# Altium schematic sheet fpga_sheet.SchDoc
size A4
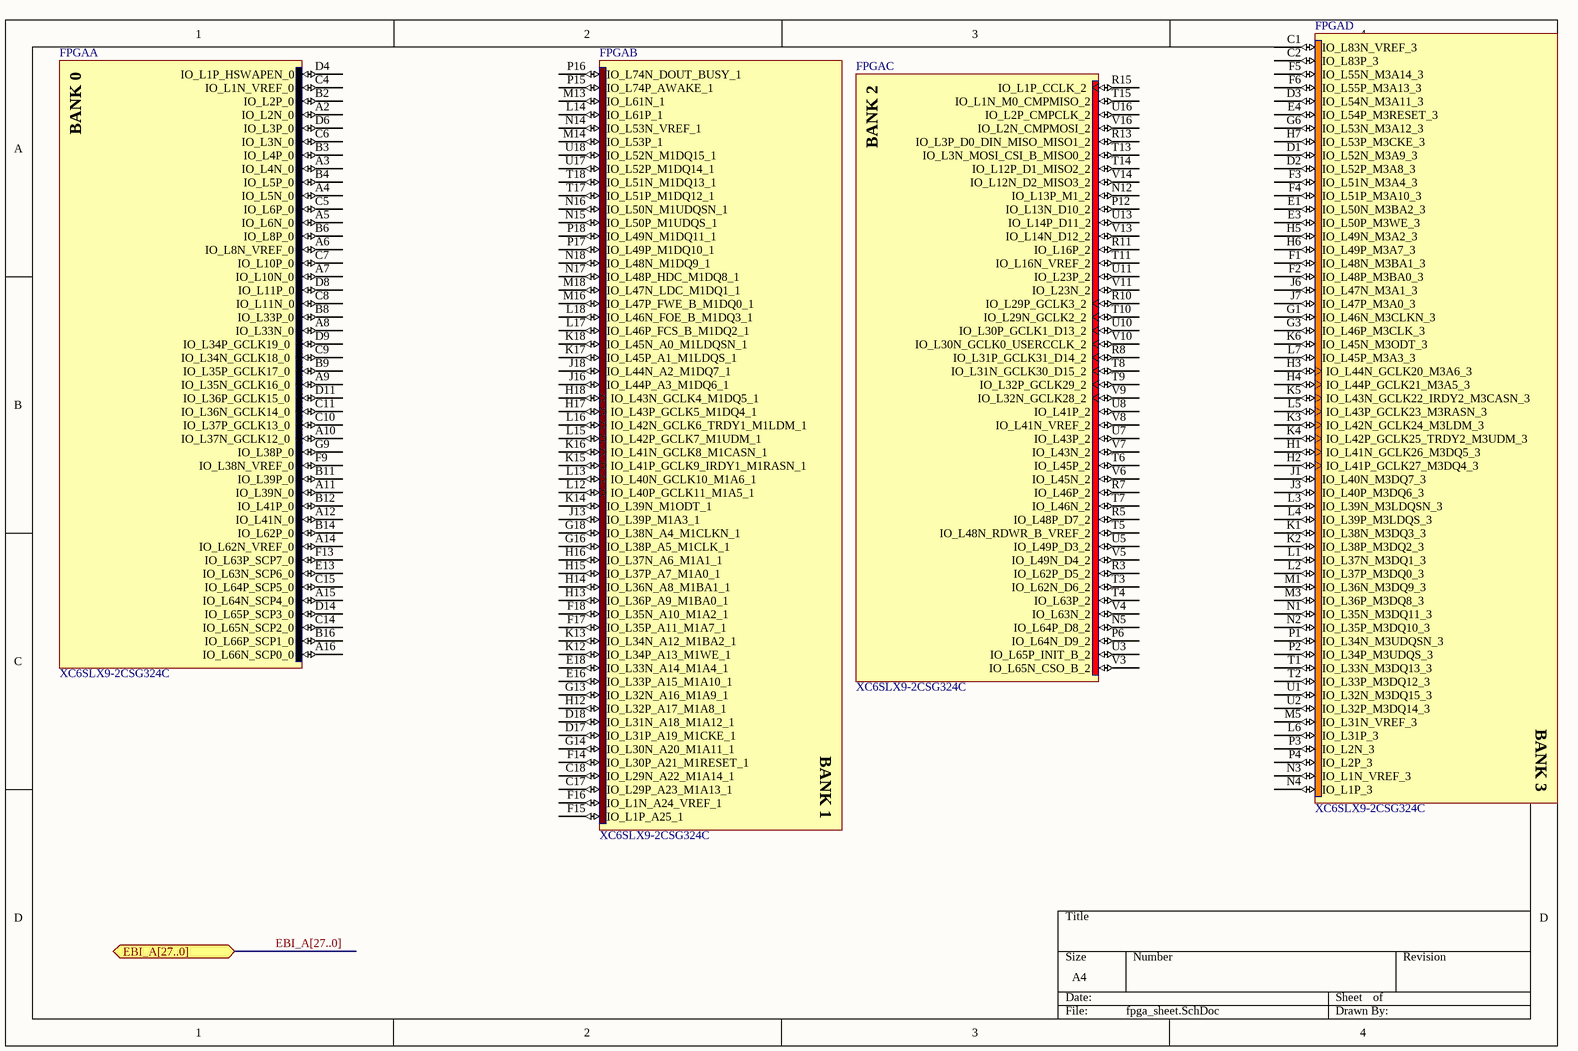
[diagram p0: fpga_sheet.SchDoc]

## Parts
FPGA  XC6SLX9-2CSG324C  [CSG324]  (parts A,B,C,D of 8)

## Ports
EBI_A[27..0]

## Nets

Not connected (* = marked no-connect by the designer): FPGA A2(IO_L2N_0) A3(IO_L4N_0) A4(IO_L5N_0) A5(IO_L6N_0) A6(IO_L8N_VREF_0) A7(IO_L10N_0) A8(IO_L33N_0) A9(IO_L35N_GCLK16_0) A10(IO_L37N_GCLK12_0) A11(IO_L39N_0) A12(IO_L41N_0) A14(IO_L62N_VREF_0) A15(IO_L64N_SCP4_0) A16(IO_L66N_SCP0_0) B2(IO_L2P_0) B3(IO_L4P_0) B4(IO_L5P_0) B6(IO_L8P_0) B8(IO_L33P_0) B9(IO_L35P_GCLK17_0) B11(IO_L39P_0) B12(IO_L41P_0) B14(IO_L62P_0) B16(IO_L66P_SCP1_0) C1(IO_L83N_VREF_3) C2(IO_L83P_3) C4(IO_L1N_VREF_0) C5(IO_L6P_0) C6(IO_L3N_0) C7(IO_L10P_0) C8(IO_L11N_0) C9(IO_L34N_GCLK18_0) C10(IO_L37P_GCLK13_0) C11(IO_L36N_GCLK14_0) C14(IO_L65N_SCP2_0) C15(IO_L64P_SCP5_0) C17(IO_L29P_A23_M1A13_1) C18(IO_L29N_A22_M1A14_1) D1(IO_L52N_M3A9_3) D2(IO_L52P_M3A8_3) D3(IO_L54N_M3A11_3) D4(IO_L1P_HSWAPEN_0) D6(IO_L3P_0) D8(IO_L11P_0) D9(IO_L34P_GCLK19_0) D11(IO_L36P_GCLK15_0) D14(IO_L65P_SCP3_0) D17(IO_L31P_A19_M1CKE_1) D18(IO_L31N_A18_M1A12_1) E1(IO_L50N_M3BA2_3) E3(IO_L50P_M3WE_3) E4(IO_L54P_M3RESET_3) E13(IO_L63N_SCP6_0) E16(IO_L33P_A15_M1A10_1) E18(IO_L33N_A14_M1A4_1) F1(IO_L48N_M3BA1_3) F2(IO_L48P_M3BA0_3) F3(IO_L51N_M3A4_3) F4(IO_L51P_M3A10_3) F5(IO_L55N_M3A14_3) F6(IO_L55P_M3A13_3) F9(IO_L38N_VREF_0) F13(IO_L63P_SCP7_0) F14(IO_L30P_A21_M1RESET_1) F15(IO_L1P_A25_1) F16(IO_L1N_A24_VREF_1) F17(IO_L35P_A11_M1A7_1) F18(IO_L35N_A10_M1A2_1) G1(IO_L46N_M3CLKN_3) G3(IO_L46P_M3CLK_3) G6(IO_L53N_M3A12_3) G9(IO_L38P_0) G13(IO_L32N_A16_M1A9_1) G14(IO_L30N_A20_M1A11_1) G16(IO_L38P_A5_M1CLK_1) G18(IO_L38N_A4_M1CLKN_1) H1(IO_L41N_GCLK26_M3DQ5_3) H2(IO_L41P_GCLK27_M3DQ4_3) H3(IO_L44N_GCLK20_M3A6_3) H4(IO_L44P_GCLK21_M3A5_3) H5(IO_L49N_M3A2_3) H6(IO_L49P_M3A7_3) H7(IO_L53P_M3CKE_3) H12(IO_L32P_A17_M1A8_1) H13(IO_L36P_A9_M1BA0_1) H14(IO_L36N_A8_M1BA1_1) H15(IO_L37P_A7_M1A0_1) H16(IO_L37N_A6_M1A1_1) H17(IO_L43P_GCLK5_M1DQ4_1) H18(IO_L43N_GCLK4_M1DQ5_1) J1(IO_L40N_M3DQ7_3) J3(IO_L40P_M3DQ6_3) J6(IO_L47N_M3A1_3) J7(IO_L47P_M3A0_3) J13(IO_L39P_M1A3_1) J16(IO_L44P_A3_M1DQ6_1) J18(IO_L44N_A2_M1DQ7_1) K1(IO_L38N_M3DQ3_3) K2(IO_L38P_M3DQ2_3) K3(IO_L42N_GCLK24_M3LDM_3) K4(IO_L42P_GCLK25_TRDY2_M3UDM_3) K5(IO_L43N_GCLK22_IRDY2_M3CASN_3) K6(IO_L45N_M3ODT_3) K12(IO_L34P_A13_M1WE_1) K13(IO_L34N_A12_M1BA2_1) K14(IO_L39N_M1ODT_1) K15(IO_L41P_GCLK9_IRDY1_M1RASN_1) K16(IO_L41N_GCLK8_M1CASN_1) K17(IO_L45P_A1_M1LDQS_1) K18(IO_L45N_A0_M1LDQSN_1) L1(IO_L37N_M3DQ1_3) L2(IO_L37P_M3DQ0_3) L3(IO_L39N_M3LDQSN_3) L4(IO_L39P_M3LDQS_3) L5(IO_L43P_GCLK23_M3RASN_3) L6(IO_L31P_3) L7(IO_L45P_M3A3_3) L12(IO_L40P_GCLK11_M1A5_1) L13(IO_L40N_GCLK10_M1A6_1) L14(IO_L61P_1) L15(IO_L42P_GCLK7_M1UDM_1) L16(IO_L42N_GCLK6_TRDY1_M1LDM_1) L17(IO_L46P_FCS_B_M1DQ2_1) L18(IO_L46N_FOE_B_M1DQ3_1) M1(IO_L36N_M3DQ9_3) M3(IO_L36P_M3DQ8_3) M5(IO_L31N_VREF_3) M13(IO_L61N_1) M14(IO_L53P_1) M16(IO_L47P_FWE_B_M1DQ0_1) M18(IO_L47N_LDC_M1DQ1_1) N1(IO_L35N_M3DQ11_3) N2(IO_L35P_M3DQ10_3) N3(IO_L1N_VREF_3) N4(IO_L1P_3) N5(IO_L64P_D8_2) N12(IO_L13P_M1_2) N14(IO_L53N_VREF_1) N15(IO_L50P_M1UDQS_1) N16(IO_L50N_M1UDQSN_1) N17(IO_L48P_HDC_M1DQ8_1) N18(IO_L48N_M1DQ9_1) P1(IO_L34N_M3UDQSN_3) P2(IO_L34P_M3UDQS_3) P3(IO_L2N_3) P4(IO_L2P_3) P6(IO_L64N_D9_2) P12(IO_L13N_D10_2) P15(IO_L74P_AWAKE_1) P16(IO_L74N_DOUT_BUSY_1) P17(IO_L49P_M1DQ10_1) P18(IO_L49N_M1DQ11_1) R3(IO_L62P_D5_2) R5(IO_L48P_D7_2) R7(IO_L46P_2) R8(IO_L31P_GCLK31_D14_2) R10(IO_L29P_GCLK3_2) R11(IO_L16P_2) R13(IO_L3P_D0_DIN_MISO_MISO1_2) R15(IO_L1P_CCLK_2) T1(IO_L33N_M3DQ13_3) T2(IO_L33P_M3DQ12_3) T3(IO_L62N_D6_2) T4(IO_L63P_2) T5(IO_L48N_RDWR_B_VREF_2) T6(IO_L45P_2) T7(IO_L46N_2) T8(IO_L31N_GCLK30_D15_2) T9(IO_L32P_GCLK29_2) T10(IO_L29N_GCLK2_2) T11(IO_L16N_VREF_2) T13(IO_L3N_MOSI_CSI_B_MISO0_2) T14(IO_L12P_D1_MISO2_2) T15(IO_L1N_M0_CMPMISO_2) T17(IO_L51P_M1DQ12_1) T18(IO_L51N_M1DQ13_1) U1(IO_L32N_M3DQ15_3) U2(IO_L32P_M3DQ14_3) U3(IO_L65P_INIT_B_2) U5(IO_L49P_D3_2) U7(IO_L43P_2) U8(IO_L41P_2) U10(IO_L30P_GCLK1_D13_2) U11(IO_L23P_2) U13(IO_L14P_D11_2) U16(IO_L2P_CMPCLK_2) U17(IO_L52P_M1DQ14_1) U18(IO_L52N_M1DQ15_1) V3(IO_L65N_CSO_B_2) V4(IO_L63N_2) V5(IO_L49N_D4_2) V6(IO_L45N_2) V7(IO_L43N_2) V8(IO_L41N_VREF_2) V9(IO_L32N_GCLK28_2) V10(IO_L30N_GCLK0_USERCCLK_2) V11(IO_L23N_2) V13(IO_L14N_D12_2) V14(IO_L12N_D2_MISO3_2) V16(IO_L2N_CMPMOSI_2)

## Buses and harness runs
bus EBI_A[27..0] = port EBI_A[27..0]

## Notes on the sheet
- (in symbol XC6SLX9-2CSG324C, part A) BANK 0
- (in symbol XC6SLX9-2CSG324C, part B) BANK 1
- (in symbol XC6SLX9-2CSG324C, part C) BANK 2
- (in symbol XC6SLX9-2CSG324C, part D) BANK 3

## Library data of the parts
FPGA = XC6SLX9-2CSG324C: Spartan-6 LX 1.2V FPGA, 200 User I/Os, 324-Ball Chip-Scale BGA (0.8mm Pitch), Speed Grade 2, Commercial Grade, Pb-Free; DatasheetVersion: ver1.6, Nov-2010; PackageVersion: ver1.1, Nov-2009; PackageReference: CSG324; PackageDescription: 324-Ball Chip-Scale BGA (CSG324) Package, 0.8 mm Pitch; Code_JEDEC: MO-275-KKAC-1; ComponentLink1Description: Manufacturer URL; ComponentLink1URL: http://www.xilinx.com/; ComponentLink2Description: Spartan-6 Datasheet; ComponentLink2URL: http://www.xilinx.com/support/documentation/data_sheets/ds160.pdf; ComponentLink3Description: Spartan-6 Documents; ComponentLink3URL: http://www.xilinx.com/support/documentation/spartan-6.htm